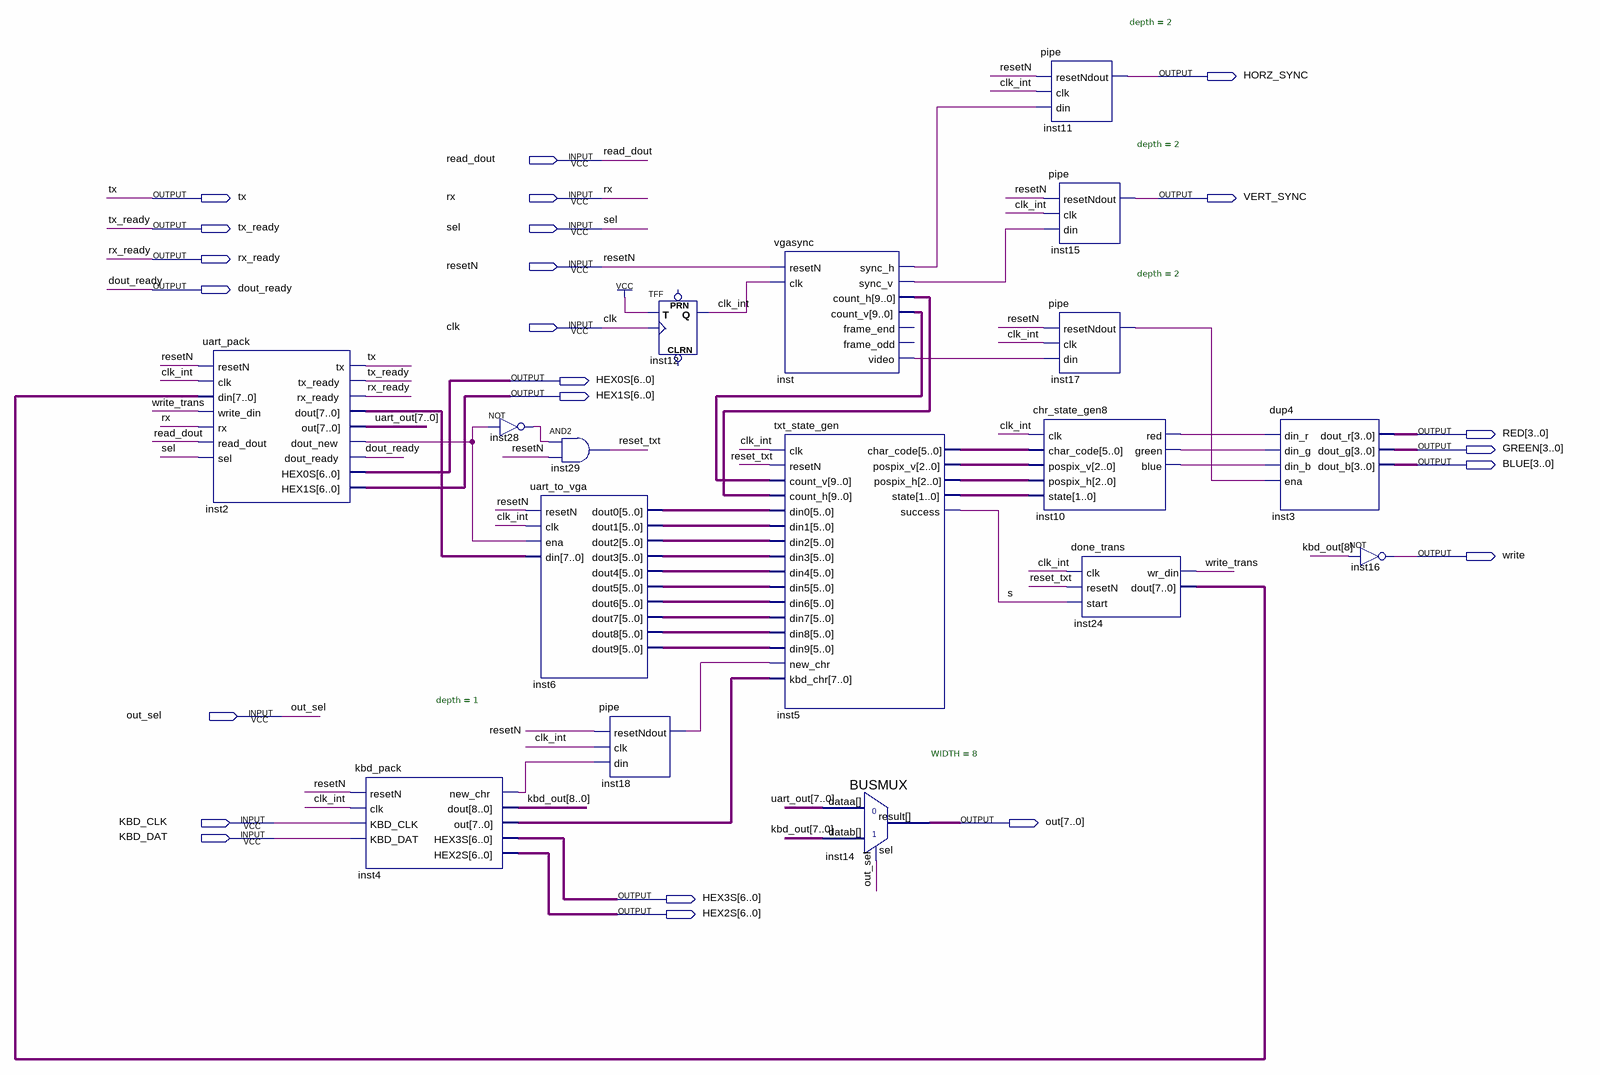
[diagram p0: schematic sheet]
// Quartus schematic game_level.bdf as structural Verilog: 17 symbols, 23 pins
module game_level (
  input  read_dout,
  input  rx,
  input  sel,
  input  resetN,
  input  clk,
  input  out_sel,
  input  KBD_CLK,
  input  KBD_DAT,
  output HORZ_SYNC,
  output tx,
  output VERT_SYNC,
  output tx_ready,
  output rx_ready,
  output dout_ready,
  output [6:0] HEX0S,
  output [6:0] HEX1S,
  output [3:0] RED,
  output [3:0] GREEN,
  output [3:0] BLUE,
  output write,
  output [7:0] out,
  output [6:0] HEX3S,
  output [6:0] HEX2S
);

  wire clk_int, inst2_dout_new, inst4_new_chr, inst10_blue, inst10_green, inst10_red, inst17_dout,
       inst18_dout, inst28_out, inst_sync_h, inst_sync_v, inst_video, reset_txt, s, write_trans;
  wire [1:0] inst5_state;
  wire [2:0] inst5_pospix_h, inst5_pospix_v;
  wire [5:0] inst5_char_code, inst6_dout0, inst6_dout1, inst6_dout2, inst6_dout3, inst6_dout4, inst6_dout5,
       inst6_dout6, inst6_dout7, inst6_dout8, inst6_dout9;
  wire [7:0] inst2_dout, inst4_out, inst24_dout, uart_out;
  wire [8:0] kbd_out;
  wire [9:0] inst_count_h, inst_count_v;

  uart_pack inst2 (
    .resetN(resetN), .clk(clk_int), .din(inst24_dout), .write_din(write_trans), .rx(rx),
    .read_dout(read_dout), .sel(sel), .tx(tx), .tx_ready(tx_ready), .rx_ready(rx_ready), .dout(inst2_dout),
    .out(uart_out), .dout_new(inst2_dout_new), .dout_ready(dout_ready), .HEX0S(HEX0S), .HEX1S(HEX1S));
  kbd_pack inst4 (
    .resetN(resetN), .clk(clk_int), .KBD_CLK(KBD_CLK), .KBD_DAT(KBD_DAT), .new_chr(inst4_new_chr),
    .dout(kbd_out), .out(inst4_out), .HEX3S(HEX3S), .HEX2S(HEX2S));
  not inst28 (inst28_out, inst2_dout_new);
  and inst29 (reset_txt, inst28_out, resetN);
  uart_to_vga inst6 (
    .resetN(resetN), .clk(clk_int), .ena(inst2_dout_new), .din(inst2_dout), .dout0(inst6_dout0),
    .dout1(inst6_dout1), .dout2(inst6_dout2), .dout3(inst6_dout3), .dout4(inst6_dout4), .dout5(inst6_dout5),
    .dout6(inst6_dout6), .dout7(inst6_dout7), .dout8(inst6_dout8), .dout9(inst6_dout9));
  pipe #(.depth(1)) inst18 (.resetN(resetN), .clk(clk_int), .din(inst4_new_chr), .dout(inst18_dout));
  TFF inst12 (.T(1'b1), .CLK(clk), .Q(clk_int));  // open: PRN, CLRN
  vgasync inst (
    .resetN(resetN), .clk(clk_int), .sync_h(inst_sync_h), .sync_v(inst_sync_v), .count_h(inst_count_h),
    .count_v(inst_count_v), .video(inst_video));  // open: frame_end, frame_odd
  txt_state_gen inst5 (
    .clk(clk_int), .resetN(reset_txt), .count_v(inst_count_v), .count_h(inst_count_h), .din0(inst6_dout0),
    .din1(inst6_dout1), .din2(inst6_dout2), .din3(inst6_dout3), .din4(inst6_dout4), .din5(inst6_dout5),
    .din6(inst6_dout6), .din7(inst6_dout7), .din8(inst6_dout8), .din9(inst6_dout9), .new_chr(inst18_dout),
    .kbd_chr(inst4_out), .char_code(inst5_char_code), .pospix_v(inst5_pospix_v), .pospix_h(inst5_pospix_h),
    .state(inst5_state), .success(s));
  BUSMUX #(.WIDTH(8)) inst14 (.datab(kbd_out[7:0]), .sel(out_sel), .dataa(uart_out), .result(out));
  pipe #(.depth(2)) inst11 (.resetN(resetN), .clk(clk_int), .din(inst_sync_h), .dout(HORZ_SYNC));
  pipe #(.depth(2)) inst15 (.resetN(resetN), .clk(clk_int), .din(inst_sync_v), .dout(VERT_SYNC));
  pipe #(.depth(2)) inst17 (.resetN(resetN), .clk(clk_int), .din(inst_video), .dout(inst17_dout));
  chr_state_gen8 inst10 (
    .clk(clk_int), .char_code(inst5_char_code), .pospix_v(inst5_pospix_v), .pospix_h(inst5_pospix_h),
    .state(inst5_state), .red(inst10_red), .green(inst10_green), .blue(inst10_blue));
  done_trans inst24 (.clk(clk_int), .resetN(reset_txt), .start(s), .wr_din(write_trans), .dout(inst24_dout));
  dup4 inst3 (
    .din_r(inst10_red), .din_g(inst10_green), .din_b(inst10_blue), .ena(inst17_dout), .dout_r(RED),
    .dout_g(GREEN), .dout_b(BLUE));
  not inst16 (write, kbd_out[8]);
endmodule
